# EAGLE schematic power_1.0 (EAGLE 9.5.2)
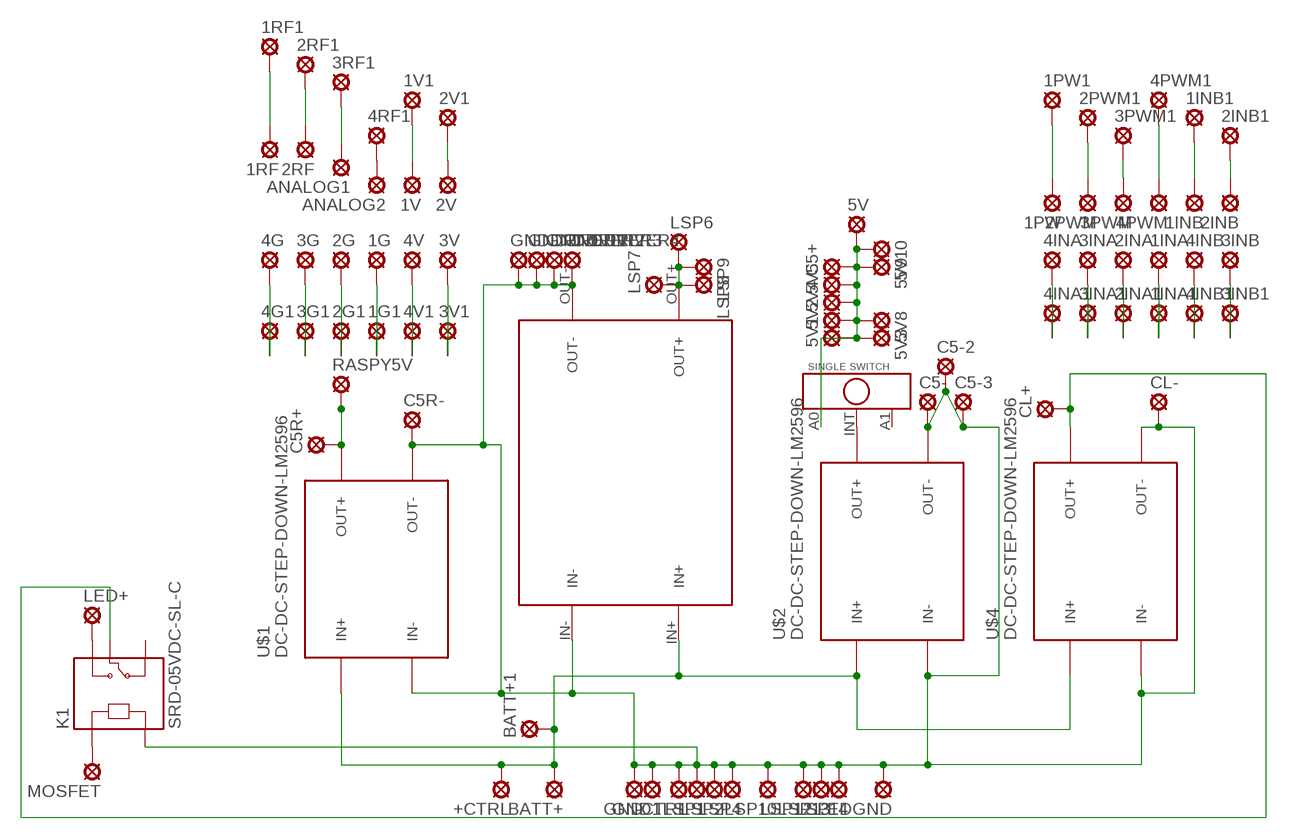
[diagram p0: schematic, sheet 1]

## Parts
1G  LSP10  [LSP10]
1G1  LSP10  [LSP10]
1INA  LSP10  [LSP10]
1INA1  LSP10  [LSP10]
1INB  LSP10  [LSP10]
1INB1  LSP10  [LSP10]
1PW  LSP10  [LSP10]
1PW1  LSP10  [LSP10]
1RF  LSP10  [LSP10]
1RF1  LSP10  [LSP10]
1V  LSP10  [LSP10]
1V1  LSP10  [LSP10]
2G  LSP10  [LSP10]
2G1  LSP10  [LSP10]
2INA  LSP10  [LSP10]
2INA1  LSP10  [LSP10]
2INB  LSP10  [LSP10]
2INB1  LSP10  [LSP10]
2PWM  LSP10  [LSP10]
2PWM1  LSP10  [LSP10]
2RF  LSP10  [LSP10]
2RF1  LSP10  [LSP10]
2V  LSP10  [LSP10]
2V1  LSP10  [LSP10]
3G  LSP10  [LSP10]
3G1  LSP10  [LSP10]
3INA  LSP10  [LSP10]
3INA1  LSP10  [LSP10]
3INB  LSP10  [LSP10]
3INB1  LSP10  [LSP10]
3PWM  LSP10  [LSP10]
3PWM1  LSP10  [LSP10]
3RF1  LSP10  [LSP10]
3V  LSP10  [LSP10]
3V1  LSP10  [LSP10]
4G  LSP10  [LSP10]
4G1  LSP10  [LSP10]
4INA  LSP10  [LSP10]
4INA1  LSP10  [LSP10]
4INB  LSP10  [LSP10]
4INB1  LSP10  [LSP10]
4PWM  LSP10  [LSP10]
4PWM1  LSP10  [LSP10]
4RF1  LSP10  [LSP10]
4V  LSP10  [LSP10]
4V1  LSP10  [LSP10]
5V  LSP10  [LSP10]
5V1  LSP10  [LSP10]
5V2  LSP10  [LSP10]
5V3  LSP10  [LSP10]
5V4  LSP10  [LSP10]
5V5  LSP10  [LSP10]
5V8  LSP10  [LSP10]
5V9  LSP10  [LSP10]
5V10  LSP10  [LSP10]
+CTRL  LSP10  [LSP10]
-CTRL  LSP10  [LSP10]
ANALOG1  LSP10  [LSP10]
ANALOG2  LSP10  [LSP10]
BATT+  SE14  [SE14]
BATT+1  SE14  [SE14]
C5+  LSP10  [LSP10]
C5-  LSP10  [LSP10]
C5-2  LSP10  [LSP10]
C5-3  LSP10  [LSP10]
C5R+  LSP10  [LSP10]
C5R-  LSP10  [LSP10]
CL+  LSP10  [LSP10]
CL-  LSP10  [LSP10]
GND  SE14  [SE14]
GND1  SE14  [SE14]
GNDDRIVER1  SE14  [SE14]
GNDDRIVER2  SE14  [SE14]
GNDDRIVER3  SE14  [SE14]
GNDDRIVER4  SE14  [SE14]
K1  SRD-05VDC-SL-C  [RELAY_SRD-05VDC-SL-C]
LED+  SE14  [SE14]
LEDGND  SE14  [SE14]
LSP1  LSP10  [LSP10]
LSP2  LSP10  [LSP10]
LSP4  LSP10  [LSP10]
LSP6  SE14  [SE14]
LSP7  SE14  [SE14]
LSP8  SE14  [SE14]
LSP9  SE14  [SE14]
LSP10  LSP10  [LSP10]
LSP12  LSP10  [LSP10]
LSP13  LSP10  [LSP10]
LSP14  LSP10  [LSP10]
MOSFET  LSP10  [LSP10]
RASPY5V  LSP10  [LSP10]
U$1  DC-DC-STEP-DOWN-LM2596  [DC-DC-STEP-DOWN-LM2596]
U$2  DC-DC-STEP-DOWN-LM2596  [DC-DC-STEP-DOWN-LM2596]
U$3  DC-DCSTEPUP/DOWNBUCKCONVERTER  [DC-DCSTEPUP/DOWNBUCKCONVERTER]
U$4  DC-DC-STEP-DOWN-LM2596  [DC-DC-STEP-DOWN-LM2596]
U$5  SINGE_SWITCH  [SINGLE_SWITCH]

## Nets
GND: -CTRL.MP C5-2.MP C5-3.MP C5-.MP C5R-.MP CL-.MP GND1.MP GND.MP GNDDRIVER1.MP GNDDRIVER2.MP GNDDRIVER3.MP GNDDRIVER4.MP K1.A2 LEDGND.MP LSP1.MP LSP2.MP LSP4.MP LSP10.MP LSP12.MP LSP13.MP LSP14.MP U$1.IN- U$1.OUT- U$2.IN- U$2.OUT- U$3.IN- U$3.OUT- U$4.IN- U$4.OUT-
N$1: U$2.OUT+ U$5.INT
N$2 [power]: LSP6.MP LSP7.MP LSP8.MP LSP9.MP U$3.OUT+
N$3: C5R+.MP RASPY5V.MP U$1.OUT+
N$4: 5V1.MP 5V2.MP 5V3.MP 5V4.MP 5V5.MP 5V8.MP 5V9.MP 5V10.MP 5V.MP C5+.MP U$5.A0
N$5: 4G1.MP 4G.MP
N$6: 3G1.MP 3G.MP
N$7: 2G1.MP 2G.MP
N$8: 1G1.MP 1G.MP
N$9: 4V1.MP 4V.MP
N$10: 3V1.MP 3V.MP
N$11: 2V1.MP 2V.MP
N$12: 1V1.MP 1V.MP
N$13: 4RF1.MP ANALOG2.MP
N$14: 3RF1.MP ANALOG1.MP
N$15: 2RF1.MP 2RF.MP
N$16: 1RF1.MP 1RF.MP
N$17: 1PW1.MP 1PW.MP
N$18: 2PWM1.MP 2PWM.MP
N$19: 4INA1.MP 4INA.MP
N$20: 3INA1.MP 3INA.MP
N$21: 2INA1.MP 2INA.MP
N$22: 1INA1.MP 1INA.MP
N$23: 4INB1.MP 4INB.MP
N$24: 3INB1.MP 3INB.MP
N$25: 3PWM1.MP 3PWM.MP
N$26: 4PWM1.MP 4PWM.MP
N$27: 1INB1.MP 1INB.MP
N$28: 2INB1.MP 2INB.MP
N$29 [power]: K1.NO LED+.MP
N$30: K1.A1 MOSFET.MP
N$31 [power]: CL+.MP K1.COM U$4.OUT+
N$35 [power]: +CTRL.MP BATT+1.MP BATT+.MP U$1.IN+ U$2.IN+ U$3.IN+ U$4.IN+
Unconnected: K1.NC U$5.A1

## Library data of the parts
1G 1G1 1INA 1INA1 1INB 1INB1 1PW 1PW1 1RF 1RF1 1V 1V1 2G 2G1 2INA 2INA1 2INB 2INB1 2PWM 2PWM1 2RF 2RF1 2V 2V1 3G 3G1 3INA 3INA1 3INB 3INB1 3PWM 3PWM1 3RF1 3V 3V1 4G 4G1 4INA 4INA1 4INB 4INB1 4PWM 4PWM1 4RF1 4V 4V1 5V 5V1-5V5 5V8-5V10 +CTRL -CTRL ANALOG1 ANALOG2 C5+ C5- C5-2 C5-3 C5R+ C5R- CL+ CL- LSP1 LSP2 LSP4 LSP10 LSP12-LSP14 MOSFET RASPY5V = solpad:LSP10: SOLDER PAD drill 1.0 mm, distributor Buerklin, 12H555
BATT+ BATT+1 GND GND1 GNDDRIVER1-GNDDRIVER4 LED+ LEDGND LSP6-LSP9 = solpad:SE14: SOLDER PAD E1553, drill 1,4mm, distributor Buerklin, 07F820
K1 = SRD-05VDC-SL-C:SRD-05VDC-SL-C: 5V Trigger Relay Module For Arduino And Raspberry Pi 5V Trigger Relay Module For Arduino And Raspberry Pi; AVAILABILITY: Unavailable; DESCRIPTION: 5V Trigger Relay Module For Arduino And Raspberry Pi 5V Trigger Relay Module For Arduino And Raspberry Pi; MF: Songle Relay; MP: SRD-05VDC-SL-C; PACKAGE: None; PRICE: None
U$1 U$2 U$4 = diy-modmod:DC-DC-STEP-DOWN-LM2596: DC/DC Step-Down Regulator based on LM2596-ADJ chip LM2596 datasheet available here: http://www.ti.com/lit/ds/symlink/lm2596.pdf Click here to find device on ebay.com <http://www.ebay.com/sch/lm2596+power+regulator>
U$3 = Buck Converter:DC-DCSTEPUP/DOWNBUCKCONVERTER
U$5 = CdiClementina:SINGE_SWITCH: Single Switch with 3 pin

## Net classes
1 power: width 3 mm, clearance 1 mm